# Altium schematic sheet Sheet1.SchDoc
size 406 x 406 mm; SheetNumber: 1; SheetTotal: 1
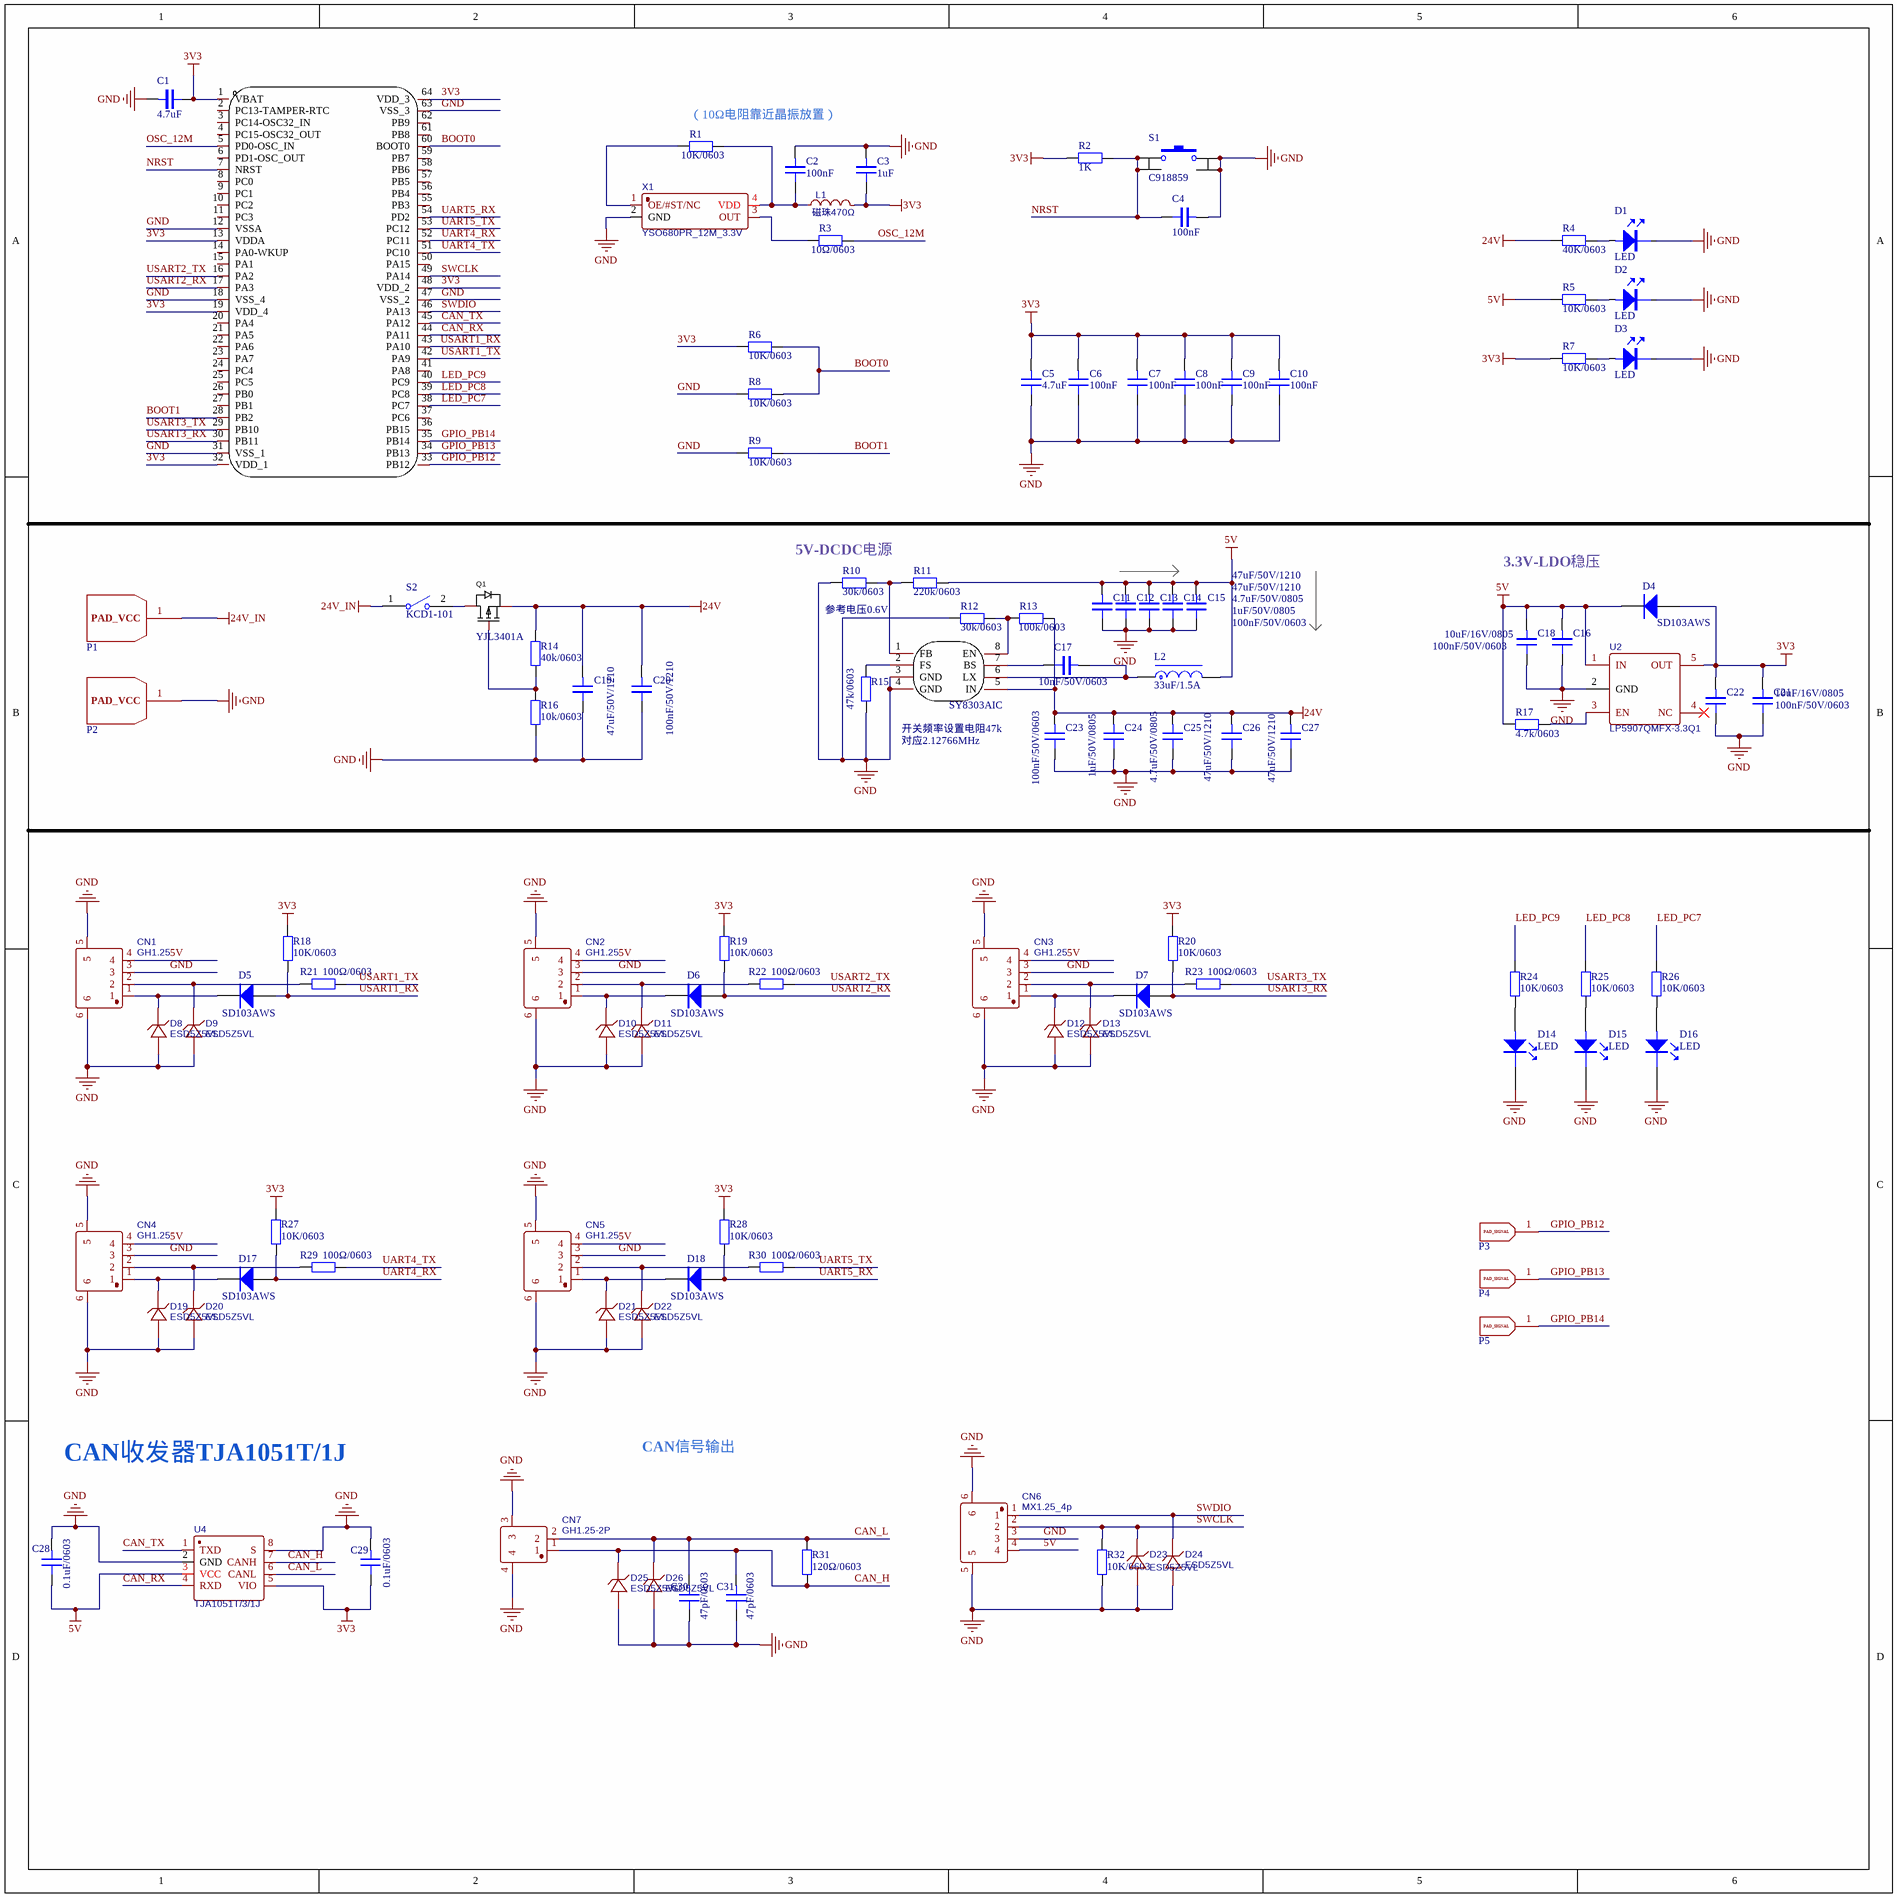
[diagram p0: Sheet1.SchDoc]

## Parts
C1  4.7uF  [C 0603_L]
C2  100nF  [C 0603_L]
C3  1uF  [C 0603_L]
C4  100nF  [C 0603_L]
C5  4.7uF  [C 0603_L]
C6  100nF  [C 0603_L]
C7  100nF  [C 0603_L]
C8  100nF  [C 0603_L]
C9  100nF  [C 0603_L]
C10  100nF  [C 0603_L]
C11  47uF/50V/1210  [C 1210_L]
C12  47uF/50V/1210  [C 1210_L]
C13  4.7uF/50V/0805  [C 0805_L]
C14  1uF/50V/0805  [C 0805_L]
C15  100nF/50V/0603  [C 0603_L]
C16  100nF/50V/0603  [C 0603_L]
C17  10nF/50V/0603  [C 0603_L]
C18  10uF/16V/0805  [C 0805_L]
C19  47uF/50V/1210  [C 1210_L]
C20  100nF/50V/1210  [C 0603_L]
C21  100nF/50V/0603  [C 0603_L]
C22  10uF/16V/0805  [C 0805_L]
C23  100nF/50V/0603  [C 0603_L]
C24  1uF/50V/0805  [C 0805_L]
C25  4.7uF/50V/0805  [C 0805_L]
C26  47uF/50V/1210  [C 1210_L]
C27  47uF/50V/1210  [C 1210_L]
C28  0.1uF/0603  [C 0603_L]
C29  0.1uF/0603  [C 0603_L]
C30  47pF/0603  [C 0603_L]
C31  47pF/0603  [C 0603_L]
CN1  GH1.25  [GH1.25 4P-WT]
CN2  GH1.25  [GH1.25 4P-WT]
CN3  GH1.25  [GH1.25 4P-WT]
CN4  GH1.25  [GH1.25 4P-WT]
CN5  GH1.25  [GH1.25 4P-WT]
CN6  MX1.25_4p  [MX1.25_4PIN]
CN7  GH1.25-2P  [GH1.25-2P-LT]
D1  LED  [LED_0603]
D2  LED  [LED_0603]
D3  LED  [LED_0603]
D4  SD103AWS  [SOD-323]
D5  SD103AWS  [SOD-323]
D6  SD103AWS  [SOD-323]
D7  SD103AWS  [SOD-323]
D8  ESD5Z5VL  [SOD-523]
D9  ESD5Z5VL  [SOD-523]
D10  ESD5Z5VL  [SOD-523]
D11  ESD5Z5VL  [SOD-523]
D12  ESD5Z5VL  [SOD-523]
D13  ESD5Z5VL  [SOD-523]
D14  LED  [LED_0603]
D15  LED  [LED_0603]
D16  LED  [LED_0603]
D17  SD103AWS  [SOD-323]
D18  SD103AWS  [SOD-323]
D19  ESD5Z5VL  [SOD-523]
D20  ESD5Z5VL  [SOD-523]
D21  ESD5Z5VL  [SOD-523]
D22  ESD5Z5VL  [SOD-523]
D23  ESD5Z5VL  [SOD-523]
D24  ESD5Z5VL  [SOD-523]
D25  ESD5Z5VL  [SOD-523]
D26  ESD5Z5VL  [SOD-523]
L1  磁珠470Ω  [C 0603_L]
L2  33uF/1.5A  [IND-SMD_L7.3-W7.3]
P1  PAD_VCC  [PAD_VCC]  (value not drawn)
P2  PAD_VCC  [PAD_VCC]  (value not drawn)
P3  PAD_Signal  [pad_signal]  (value not drawn)
P4  PAD_Signal  [pad_signal]  (value not drawn)
P5  PAD_Signal  [pad_signal]  (value not drawn)
Q1  YJL3401A  [SOT-23-3_L2.9-W1.3-P1.90-LS2.4-BR]
R1  10K/0603  [R 0603_S]
R2  1K  [R 0603_S]
R3  10Ω/0603  [R 0603_S]
R4  40K/0603  [R 0603_S]
R5  10K/0603  [R 0603_S]
R6  10K/0603  [R 0603_S]
R7  10K/0603  [R 0603_S]
R8  10K/0603  [R 0603_S]
R9  10K/0603  [R 0603_S]
R10  30k/0603  [R 0603_S]
R11  220k/0603  [R 0603_S]
R12  30k/0603  [R 0603_S]
R13  100k/0603  [R 0603_S]
R14  40k/0603  [R 0603_S]
R15  47k/0603  [R 0603_S]
R16  10k/0603  [R 0603_S]
R17  4.7k/0603  [R 0603_S]
R18  10K/0603  [R 0603_S]
R19  10K/0603  [R 0603_S]
R20  10K/0603  [R 0603_S]
R21  100Ω/0603  [R 0603_S]
R22  100Ω/0603  [R 0603_S]
R23  100Ω/0603  [R 0603_S]
R24  10K/0603  [R 0603_S]
R25  10K/0603  [R 0603_S]
R26  10K/0603  [R 0603_S]
R27  10K/0603  [R 0603_S]
R28  10K/0603  [R 0603_S]
R29  100Ω/0603  [R 0603_S]
R30  100Ω/0603  [R 0603_S]
R31  120Ω/0603  [R 0603_S]
R32  10K/0603  [R 0603_S]
S1  C918859  [KEY-4.2*3.25]
S2  KCD1-101  [SW-TH_MR5-111-C5N-BB]
U1  STM32F103RCT6  [LQFP-64_L10.0-W10.0-P0.50-LS12.0-BL]  (value not drawn)
U2  LP5907QMFX-3.3Q1  [SOT23-5N]
U3  SY8303AIC  [TSOT-23-8_L2.9-W1.6-P0.65-LS2.8-BR]
U4  TJA1051T/3/1J  [SOP8_L]
X1  YSO680PR_12M_3.3V  [OSC 3225-4P]

## Nets
3V3: C1.2 C3.2 C5.1 C6.1 C7.1 C8.1 C9.1 C10.1 C21.1 C22.1 C29.2 D4.1 L1.2 R2.1 R6.1 R7.1 R18.1 R19.1 R20.1 R27.1 R28.1 U1.1(VBAT) U1.13(VDDA) U1.19(VDD_4) U1.32(VDD_1) U1.48(VDD_2) U1.64(VDD_3) U2.5(OUT) U4.5(VIO)
5V: C11.1 C12.1 C13.1 C14.1 C15.1 C16.1 C18.1 C28.2 CN1.4 CN2.4 CN3.4 CN4.4 CN5.4 CN6.4 D4.2 L2.2 R5.1 R11.2 R17.1 U2.1(IN) U4.3(VCC)
24V: C19.1 C20.1 C23.1 C24.1 C25.1 C26.1 C27.1 Q1.2(S) R4.1 R13.2 R14.1 U3.5(IN)
24V_IN: P1.1(PAD_VCC) S2.1
GND: C1.1 C2.1 C3.1 C4.1 C5.2 C6.2 C7.2 C8.2 C9.2 C10.2 C11.2 C12.2 C13.2 C14.2 C15.2 C16.2 C18.2 C19.2 C20.2 C21.2 C22.2 C23.2 C24.2 C25.2 C26.2 C27.2 C28.1 C29.1 C30.2 C31.2 CN1.3 CN1.5 CN1.6 CN2.3 CN2.5 CN2.6 CN3.3 CN3.5 CN3.6 CN4.3 CN4.5 CN4.6 CN5.3 CN5.5 CN5.6 CN6.3 CN6.5 CN6.6 CN7.3 CN7.4 D1.2 D2.2 D3.2 D8.1(A) D9.1(A) D10.1(A) D11.1(A) D12.1(A) D13.1(A) D14.2 D15.2 D16.2 D19.1(A) D20.1(A) D21.1(A) D22.1(A) D23.1(A) D24.1(A) D25.1(A) D26.1(A) P2.1(PAD_VCC) R8.1 R9.1 R10.1 R12.1 R15.2 R16.2 R32.2 S1.3 S1.4 U1.12(VSSA) U1.18(VSS_4) U1.31(VSS_1) U1.47(VSS_2) U1.63(VSS_3) U2.2(GND) U3.3(GND) U3.4(GND) U4.2(GND) U4.8(S) X1.2(GND)
BOOT0: R6.2 R8.2 U1.60(BOOT0)
BOOT1: R9.2 U1.28(PB2)
CAN_H: C31.1 CN7.1 D25.2(C) R31.2 U4.7(CANH)
CAN_L: C30.1 CN7.2 D26.2(C) R31.1 U4.6(CANL)
CAN_RX: U1.44(PA11) U4.4(RXD)
CAN_TX: U1.45(PA12) U4.1(TXD)
GPIO_PB12: P3.1(PAD_SIGNAL) U1.33(PB12)
GPIO_PB13: P4.1(PAD_SIGNAL) U1.34(PB13)
GPIO_PB14: P5.1(PAD_SIGNAL) U1.35(PB14)
LED_PC7: R26.1 U1.38(PC7)
LED_PC8: R25.1 U1.39(PC8)
LED_PC9: R24.1 U1.40(PC9)
NRST: C4.2 R2.2 S1.1 S1.2 U1.7(NRST)
OSC_12M: R3.2 U1.5(PD0-OSC_IN)
SWCLK: CN6.2 D23.2(C) R32.1 U1.49(PA14)
SWDIO: CN6.1 D24.2(C) U1.46(PA13)
UART4_RX: D17.1 R27.2 U1.52(PC11)
UART4_TX: R29.2 U1.51(PC10)
UART5_RX: D18.1 R28.2 U1.54(PD2)
UART5_TX: R30.2 U1.53(PC12)
USART1_RX: D5.1 R18.2 U1.43(PA10)
USART1_TX: R21.2 U1.42(PA9)
USART2_RX: D6.1 R19.2 U1.17(PA3)
USART2_TX: R22.2 U1.16(PA2)
USART3_RX: D7.1 R20.2 U1.30(PB11)
USART3_TX: R23.2 U1.29(PB10)
NetC2_2: C2.2 L1.1 R1.2 X1.4(VDD)
NetC17_1: C17.1 L2.1 U3.6(LX)
NetC17_2: C17.2 U3.7(BS)
NetCN1_1: CN1.1 D5.2 D8.2(C)
NetCN1_2: CN1.2 D9.2(C) R21.1
NetCN2_1: CN2.1 D6.2 D10.2(C)
NetCN2_2: CN2.2 D11.2(C) R22.1
NetCN3_1: CN3.1 D7.2 D12.2(C)
NetCN3_2: CN3.2 D13.2(C) R23.1
NetCN4_1: CN4.1 D17.2 D19.2(C)
NetCN4_2: CN4.2 D20.2(C) R29.1
NetCN5_1: CN5.1 D18.2 D21.2(C)
NetCN5_2: CN5.2 D22.2(C) R30.1
NetD1_1: D1.1 R4.2
NetD2_1: D2.1 R5.2
NetD3_1: D3.1 R7.2
NetD14_1: D14.1 R24.2
NetD15_1: D15.1 R25.2
NetD16_1: D16.1 R26.2
NetQ1_1: Q1.1(G) R14.2 R16.1
NetQ1_3: Q1.3(D) S2.2
NetR1_1: R1.1 X1.1(OE/#ST/NC)
NetR3_1: R3.1 X1.3(OUT)
NetR10_2: R10.2 R11.1 U3.1(FB)
NetR12_2: R12.2 R13.1 U3.8(EN)
NetR15_1: R15.1 U3.2(FS)
NetR17_2: R17.2 U2.3(EN)

Not connected (* = marked no-connect by the designer): U1 2(PC13-TAMPER-RTC) 3(PC14-OSC32_IN) 4(PC15-OSC32_OUT) 6(PD1-OSC_OUT) 8(PC0) 9(PC1) 10(PC2) 11(PC3) 14(PA0-WKUP) 15(PA1) 20(PA4) 21(PA5) 22(PA6) 23(PA7) 24(PC4) 25(PC5) 26(PB0) 27(PB1) 36(PB15) 37(PC6) 41(PA8) 50(PA15) 55(PB3) 56(PB4) 57(PB5) 58(PB6) 59(PB7) 61(PB8) 62(PB9); U2 4(NC)*

## Notes on the sheet
- (near R1) （10Ω电阻靠近晶振放置）
- (near R10) 5V-DCDC电源
- (near R10) 参考电压0.6V
- 3.3V-LDO稳压
- 开关频率设置电阻47k
- 对应2.12766MHz
- CAN收发器TJA1051T/1J
- CAN信号输出

## Library data of the parts
C1-C15 C17-C20 C22-C31 = CAP: 陶瓷电容
C16 C21 = CAP: Capacitor
CN1-CN5 = GH1.25 4p: 连接端子; BOM_Manufacturer: Changjiang Connectors; BOM_Manufacturer Part: A1257WR-S-4P; Contributor: LCSC; BOM_Supplier: LCSC; BOM_Supplier Part: C225127; spicePre: C; spiceSymbolName: A1257WR-S-4P
CN6 = MX1.25_4p: 连接端子; BOM_Manufacturer: Changjiang Connectors; BOM_Manufacturer Part: A1257WR-S-4P; Contributor: LCSC; BOM_Supplier: LCSC; BOM_Supplier Part: C225127; spicePre: C; spiceSymbolName: A1257WR-S-4P
CN7 = GH1.25-2P: 连接端子; BOM_Manufacturer: Changjiang Connectors; BOM_Manufacturer Part: A1257WR-S-2P; Contributor: LCSC; BOM_Supplier: LCSC; BOM_Supplier Part: C225125; spicePre: C; spiceSymbolName: A1257WR-S-2P
D1-D3 D14-D16 = LED: 发光二极管
D4-D7 D17 D18 = SD103AWS: 二极管
D8-D13 D19-D26 = ESD5Z5VL: ESD 单向 5V; BOM_Manufacturer: MDD; BOM_Manufacturer Part: SMF6.5A; Contributor: LCSC; BOM_Supplier: LCSC; BOM_Supplier Part: C123792; BOM_JLCPCB Part Class: Extended Part; spicePre: D; spiceSymbolName: SMF6.5A
L1 = 磁珠470Ω: BOM_Manufacturer: Sunlord; BOM_Manufacturer Part: UPZ1608U471-1R5TF; nameAlias: Value; BOM_Supplier: LCSC; BOM_Supplier Part: C74335; spicePre: L; spiceSymbolName: UPZ1608U471-1R5TF
L2 = L-SMD: 贴片功率电感; BOM名称: 功率电感
Q1 = YJL3401A: Manufacturer: YANGJIE(扬杰); Add into BOM: yes; Type: P沟道; Drain Source Voltage (Vdss): 30V; Continuous Drain Current (Id): 4.4A; Power Dissipation (Pd): 1.2W; Drain Source On Resistance (RDS(on)@Vgs,Id): 55mΩ@10V,4.4A; Gate Threshold Voltage (Vgs(th)@Id): 1.4V@250μA; Name: YJL3401A; Symbol: YJL3401A; Device: YJL3401A; LCSC Part Name: P沟道 30V 4.4A; Supplier Part: C393520; Manufacturer Part: YJL3401A; Supplier Footprint: SOT-23; JLCPCB Part Class: Extended Part; Datasheet: https://atta.szlcsc.com/upload/public/pdf/source/20190516/C393520_7481F6972A00CA4C56A9B9A98BC8DB32.pdf; Supplier: LCSC; Convert to PCB: yes
R1-R32 = RES: 贴片电阻
S1 = 按键: DJI御用小按键
S2 = KCD1-101: 单刀单掷 直插立式; BOM名称: 1路单刀船型开关
U1 = STM32F103RCT6: Manufacturer: ST(意法半导体); Add into BOM: yes; CPU Core: ARM Cortex-M3; CPU Maximum Speed: 72MHz; Operating Voltage Range: 2V~3.6V; Program Storage Size: 256KB; Program Memory Type: FLASH; RAM Size: 48KB; GPIO Ports Number: 51; ADC (Bit): 12bit; Peripheral/Function: DMA；看门狗；片载温度传感器；PWM; Internal Oscillator: 有; Name: STM32F103RCT6; Symbol: STM32F103RCT6; Device: STM32F103RCT6; LCSC Part Name: ARM Cortex-M3 72MHz; Supplier Part: C8323; Manufacturer Part: STM32F103RCT6; Supplier Footprint: LQFP-64(10x10); JLCPCB Part Class: Extended Part; Datasheet: https://atta.szlcsc.com/upload/public/pdf/source/20161130/1480498797345.pdf; Supplier: LCSC; Convert to PCB: yes; EEPROM: 256KB; DAC (Bit): 12bit; PWM (Bit): -; Universal Serial Bus: -; Internal Comparator: -; communication protocol: -; Watchdog: -; Real-Time Clock: -; Infrared Data Association: -; Low-Voltage Detect: -; CCP Capture/Compare: -; Secure Digital Input and Output: -; Direct Memory Access: -; Operating Temperature Range: -40℃~+85℃
U2 = LP5907QMFX-3.3Q1: BOM_Manufacturer: TI; Contributor: LCSC; SMT Type: Extend; BOM_Supplier: LCSC; BOM_Manufacturer Part: LP5907QMFX-3.3Q1; BOM_Supplier Part: C130005; BOM_JLCPCB SMD: Yes; spicePre: U; spiceSymbolName: LP5907QMFX-3.3Q1
U3 = SY8303AIC: DCDC ADJ 3A; Manufacturer: 矽力杰silergy; Add into BOM: yes; Function: 降压型; Name: SY8303AIC; Symbol: SY8303AIC; Device: SY8303AIC; LCSC Part Name: 降压型; Supplier Part: C97054; Manufacturer Part: SY8303AIC; Supplier Footprint: TSOT-23-8; JLCPCB Part Class: Extended Part; Datasheet: https://atta.szlcsc.com/upload/public/pdf/source/20170308/1488958431714.pdf; Supplier: LCSC; Convert to PCB: yes; Synchronous Rectification: -; Number of Outputs: -; Topology: -; Input Voltage: -; Output Current (Max): -; Switching Frequency: -
U4 = TJA1051T/3/1J: CAN芯片; BOM_Manufacturer: NXP; BOM_Supplier: LCSC; BOM_Manufacturer Part: TJA1051T/3/1J; BOM_Supplier Part: C38695; BOM_JLCPCB Part Class: Extended Part; spicePre: U; spiceSymbolName: TJA1051T/3/1J
X1 = YSO680PR_12M_3.3V: 有源晶振12M; BOM_Manufacturer: Yangxing Tech; BOM_Manufacturer Part: OP322512MEDA4SI-u; nameAlias: Frequency; Contributor: LCSC; BOM_Supplier: LCSC; BOM_Supplier Part: C382483; spicePre: X; spiceSymbolName: OP322512MEDA4SI-U